# Altium schematic sheet Interface.SchDoc: VitalCore Interface
size A4; Organization: ETHZ D-ITET PBL, IIS; DocumentNumber: 2; SheetNumber: 2; SheetTotal: 3; FileInfo: Interface.SchDoc
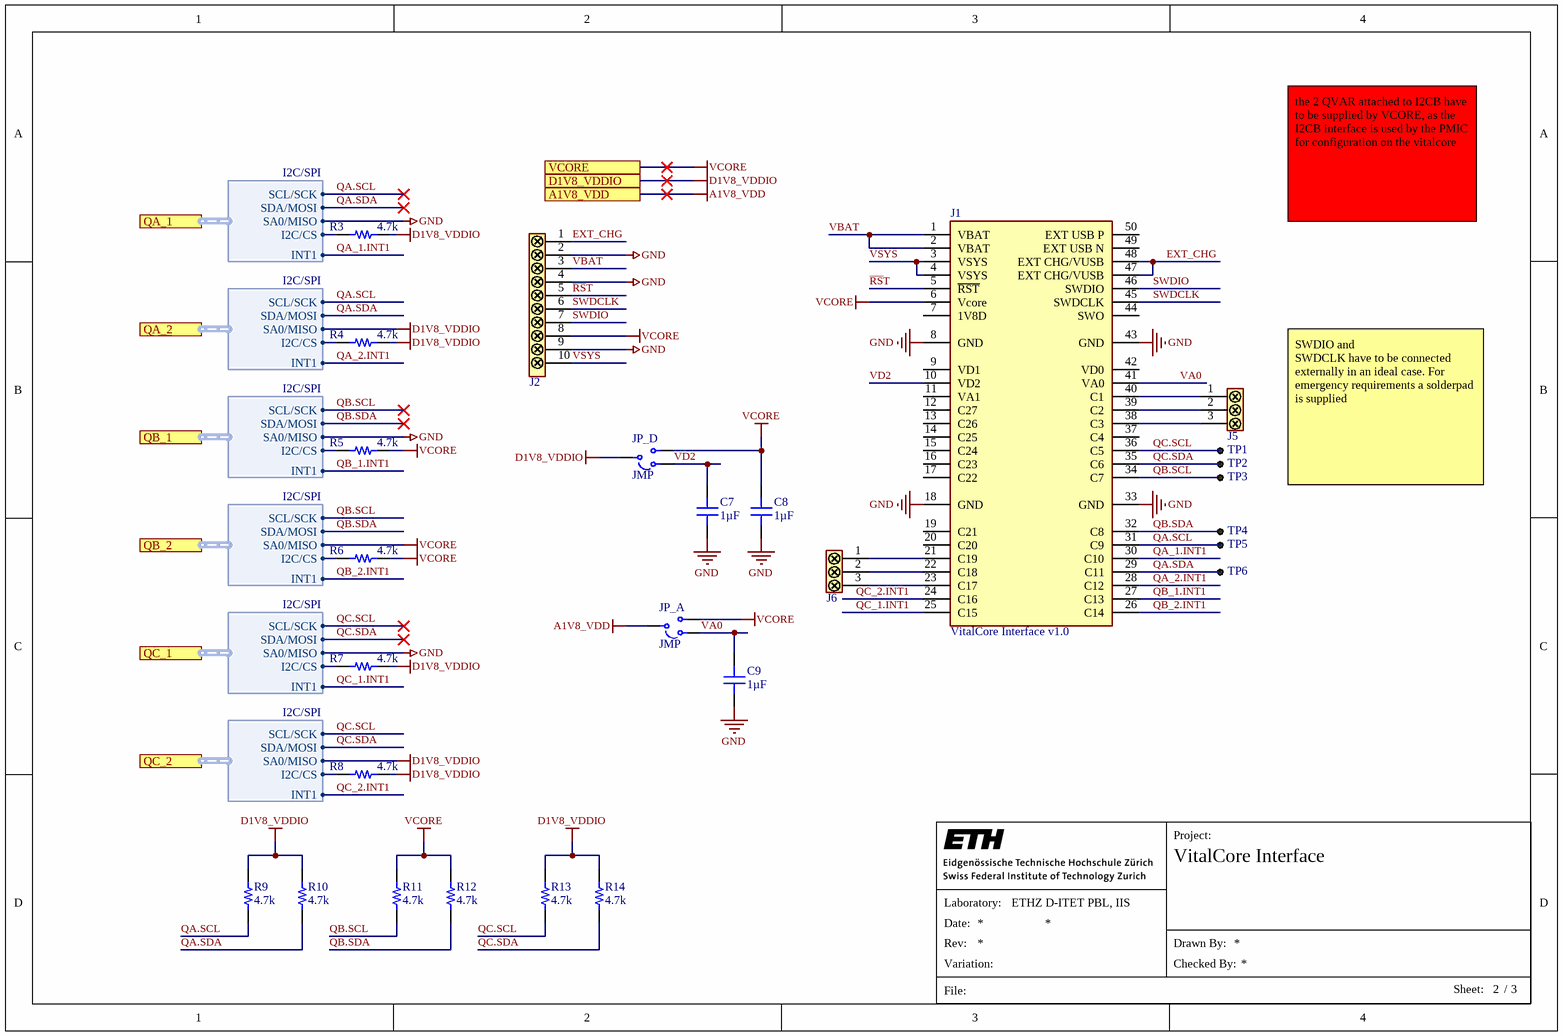
[diagram p0: Interface.SchDoc]

## Parts
C7  1µF  [CAP_0201]
C8  1µF  [CAP_0201]
C9  1µF  [CAP_0201]
J1  VitalCore Interface v1.0  [BACKPACK_INTERFACE_V1.0_2mm]
J2  FTS-110-01-L-S  [SAMTEC-FTS-110-01-L-S]  (value not drawn)
J5  FTS-103-01-L-S  [SAMTEC-FTS-103-01-X-S]  (value not drawn)
J6  FTS-103-01-L-S  [SAMTEC-FTS-103-01-X-S]  (value not drawn)
JP_A  JMP  [JMP_0201_3way]
JP_D  JMP  [JMP_0201_3way]
R3  4.7k  [RES_0201]
R4  4.7k  [RES_0201]
R5  4.7k  [RES_0201]
R6  4.7k  [RES_0201]
R7  4.7k  [RES_0201]
R8  4.7k  [RES_0201]
R9  4.7k  [RES_0201]
R10  4.7k  [RES_0201]
R11  4.7k  [RES_0201]
R12  4.7k  [RES_0201]
R13  4.7k  [RES_0201]
R14  4.7k  [RES_0201]
TP1  (no value)  [Pad-0.6mm]  (no BOM)
TP2  (no value)  [Pad-0.6mm]  (no BOM)
TP3  (no value)  [Pad-0.6mm]  (no BOM)
TP4  (no value)  [Pad-0.6mm]  (no BOM)
TP5  (no value)  [Pad-0.6mm]  (no BOM)
TP6  (no value)  [Pad-0.6mm]  (no BOM)

## Ports
A1V8_VDD, D1V8_VDDIO, QA_1 (harness I2C/SPI), QA_2 (harness I2C/SPI), QB_1 (harness I2C/SPI), QB_2 (harness I2C/SPI), QC_1 (harness I2C/SPI), QC_2 (harness I2C/SPI), VCORE

## Harnesses
I2C/SPI: SCL/SCK, SDA/MOSI, SA0/MISO, I2C/CS, INT1

## Nets
A1V8_VDD: JP_A.2 ; port A1V8_VDD
D1V8_VDDIO: JP_D.2 R3.1 R4.1 R7.1 R8.1 R9.1 R10.1 R13.1 R14.1 ; port D1V8_VDDIO, port QA_2.SA0/MISO, port QC_2.SA0/MISO
GND: C7.2 C8.2 C9.2 J1.8(GND) J1.18(GND) J1.33(GND) J1.43(GND) J2.2 J2.4 J2.9 ; port QA_1.SA0/MISO, port QB_1.SA0/MISO, port QC_1.SA0/MISO
VCORE: C8.1 J1.6(Vcore) J2.8 JP_A.3 JP_D.3 R5.1 R6.1 R11.1 R12.1 ; port VCORE, port QB_2.SA0/MISO
EXT_CHG: J1.47(EXT_CHG/VUSB) J1.48(EXT_CHG/VUSB) J2.1
QA.SCL: J1.31(C9) R9.2 TP5.1 ; port QA_1.SCL/SCK, port QA_2.SCL/SCK
QA.SDA: J1.29(C11) R10.2 TP6.1 ; port QA_1.SDA/MOSI, port QA_2.SDA/MOSI
QA_1.INT1: J1.30(C10) ; port QA_1.INT1
QA_2.INT1: J1.28(C12) ; port QA_2.INT1
QB.SCL: J1.34(C7) R11.2 TP3.1 ; port QB_1.SCL/SCK, port QB_2.SCL/SCK
QB.SDA: J1.32(C8) R12.2 TP4.1 ; port QB_1.SDA/MOSI, port QB_2.SDA/MOSI
QB_1.INT1: J1.27(C13) ; port QB_1.INT1
QB_2.INT1: J1.26(C14) ; port QB_2.INT1
QC.SCL: J1.36(C5) R13.2 TP1.1 ; port QC_1.SCL/SCK, port QC_2.SCL/SCK
QC.SDA: J1.35(C6) R14.2 TP2.1 ; port QC_1.SDA/MOSI, port QC_2.SDA/MOSI
QC_1.INT1: J1.25(C15) ; port QC_1.INT1
QC_2.INT1: J1.24(C16) ; port QC_2.INT1
~{RS}T: J1.5(~{RST}) J2.5
SWDCLK: J1.45(SWDCLK) J2.6
SWDIO: J1.46(SWDIO) J2.7
VA0: C9.1 J1.41(VA0) JP_A.1
VBAT: J1.1(VBAT) J1.2(VBAT) J2.3
VD2: C7.1 J1.10(VD2) JP_D.1
VSYS: J1.3(VSYS) J1.4(VSYS) J2.10
NetJ1_21: J1.21(C19) J6.1
NetJ1_22: J1.22(C18) J6.2
NetJ1_23: J1.23(C17) J6.3
NetJ1_38: J1.38(C3) J5.3
NetJ1_39: J1.39(C2) J5.2
NetJ1_40: J1.40(C1) J5.1
NetR3_2: R3.2 ; port QA_1.I2C/CS
NetR4_2: R4.2 ; port QA_2.I2C/CS
NetR5_2: R5.2 ; port QB_1.I2C/CS
NetR6_2: R6.2 ; port QB_2.I2C/CS
NetR7_2: R7.2 ; port QC_1.I2C/CS
NetR8_2: R8.2 ; port QC_2.I2C/CS

Not connected (* = marked no-connect by the designer): J1 7(1V8D) 9(VD1) 11(VA1) 12(C27) 13(C26) 14(C25) 15(C24) 16(C23) 17(C22) 19(C21) 20(C20) 37(C4) 42(VD0) 44(SWO) 49(EXT_USB_N) 50(EXT_USB_P)

## Notes on the sheet
- the 2 QVAR attached to I2CB have to be supplied by VCORE, as the I2CB interface is used by the PMIC for configuration on the vitalcore
- SWDIO and
  SWDCLK have to be connected externally in an ideal case. For emergency requirements a solderpad is supplied
- Project:
- Laboratory:
- Date:
- File:
- Rev:
- Variation:
- Drawn By:
- Checked By:
- Sheet:
- /

## Library data of the parts
C7-C9 = CAP_0201_1u_10V: CAP CER 1UF 10V X6S; Manufacturer: Murata; Manufacturer Part Number: GRM033C81A105ME05D; Capacitor Type: Ceramic; Multilayer: Yes; Tolerance  (fill in as +-): 20%; Supplier 1: Mouser; Supplier Part Number 1: 81-GRM033C81A105ME5D; Case/Package: 0201; Category: Ceramic Capacitors; ComponentLink1Description: https://psearch.en.murata.com:443/capacitor/product/GRM033C81A105ME05%23.pdf?src-supplier=IHS+Markit; ComponentLink1URL: https://psearch.en.murata.com:443/capacitor/product/GRM033C81A105ME05%23.pdf?src-supplier=IHS+Markit; ComponentLink2Description: http://search.murata.co.jp/Ceramy/image/img/A01X/G101/ENG/GRM033C81A105ME05-01.pdf?src-supplier=Digi-Key; ComponentLink2URL: http://search.murata.co.jp/Ceramy/image/img/A01X/G101/ENG/GRM033C81A105ME05-01.pdf?src-supplier=Digi-Key; ComponentLink3Description: https://datasheet.octopart.com/GRM033C81A105ME05D-Murata-datasheet-86813717.pdf?src-supplier=Future+Electronics; ComponentLink3URL: https://datasheet.octopart.com/GRM033C81A105ME05D-Murata-datasheet-86813717.pdf?src-supplier=Future+Electronics; ComponentLink4Description: https://datasheet.octopart.com/GRM033C81A105ME05D-Murata-datasheet-165579666.pdf?src-supplier=TME; ComponentLink4URL: https://datasheet.octopart.com/GRM033C81A105ME05D-Murata-datasheet-165579666.pdf?src-supplier=TME; Dielectric Material: Ceramic; JESD-609 Code: e3; Max Operating Temperature: 105°C; Min Operating Temperature: -55°C; Mounting Technology: Surface Mount; Package Shape: Rectangular; Packaging: Tape and Reel; Pins: 2; Pricing 1: 1=0.3, 10=0.147, 50=0.147, 100=0.095, 1000=0.079, 10000=0.066 (USD); Rated DC Voltage (URdc): 10V; Reach SVHC Compliant: Yes; RoHS: Yes; RoHS Compliant: Yes; Stock 1: 212716; Temperature Characteristics Code: X6S; Terminal Finish: Nickel; Termination: Wraparound; Tolerance (fill in as +-): 20%; Value: 1uF
J1 = BACKPACK_INTERFACE_V1.0: Manufacturer: Hirose; Manufacturer Part Number: DF40C(2.0)-50DS-0.4V(51); Manufacturer Series: DF40; Body/Shell Style: RECEPTACLE; Connector Type: BOARD STACKING CONNECTOR; Contact Pattern: RECTANGULAR; Contact Resistance: 90mR; Dielectric Withstanding Voltage (AC): 100V; Durability: 30Cycles; Insulation Resistance: 50MR; Mating Contact Pitch: 0.016inch; Mounting Option 1: LOCKING; Number Of Connectors: 1; Number of Contacts: 50; Number Of PCB Rows: 2; PCB Contact Row Spacing: 2.6416mm; Polarization Key: POLARIZED HOUSING; Rated Current (Signal): 300mA; Reference Standard: UL; Reliability: COMMERCIAL; Supplier 1: Mouser; Supplier Part Number 1: 798-DF40C2050DS04V51; Category: Connectors; ComponentLink1Description: https://datasheet.ciiva.com:443/pdfs/VipMasterIC/IC/HIRO/HIRO-S-A0003089604/HIRO-S-A0007946763-1.pdf?src-supplier=IHS+Markit; ComponentLink1URL: https://datasheet.ciiva.com:443/pdfs/VipMasterIC/IC/HIRO/HIRO-S-A0003089604/HIRO-S-A0007946763-1.pdf?src-supplier=IHS+Markit; ComponentLink2Description: https://www.hirose.com/product/download/?distributor=digikey&amp;type=specSheet&amp;lang=en&amp;num=DF40C(2.0)-50DS-0.4V(51)&src-supplier=Digi-Key; ComponentLink2URL: https://www.hirose.com/product/download/?distributor=digikey&amp;type=specSheet&amp;lang=en&amp;num=DF40C(2.0)-50DS-0.4V(51)&src-supplier=Digi-Key; ComponentLink3Description: https://www.hirose.com/product/en/download_file/key_name/DF40C%282.0%29-50DS-0.4V%2851%29/category/Specification%20Sheet/doc_file_id/46910/?file_category_id=9&item_id=06844091051&is_series=&src-supplier=Digi-Key; ComponentLink3URL: https://www.hirose.com/product/en/download_file/key_name/DF40C%282.0%29-50DS-0.4V%2851%29/category/Specification%20Sheet/doc_file_id/46910/?file_category_id=9&item_id=06844091051&is_series=&src-supplier=Digi-Key; ComponentLink4Description: http://www.hirose.co.jp/cataloge_hp/e68440018.pdf?src-supplier=Mouser; ComponentLink4URL: http://www.hirose.co.jp/cataloge_hp/e68440018.pdf?src-supplier=Mouser; Contact Finish - Mating: AU; Contact Gender: Female; Contact Material: Bronze; Insulation Color: Black; Insulation Material: Polymer; Max Operating Temperature: 85°C; Min Operating Temperature: -35°C; Mounting Style: STRAIGHT; Mounting Technology: Board; Number of Rows Loaded: 2; PCB Contact Pattern: RECTANGULAR; Pricing 1: 1=1.44, 10=1.14, 50=1.14, 100=0.99, 1000=0.792, 10000=0.643 (USD); RoHS: Yes; RoHS Compliant: Yes; Stock 1: 16932; Terminal Pitch: 4.064mm; Termination: SMD/SMT
J2 = FTS-110-01-L-S: Pinheader 10 pin, 1.27mm; Manufacturer: Samtec; Manufacturer Series: FTS; Connector Type: BOARD CONNECTOR; Option: General Purpose; Mixed Contacts: No; Number of Rows Loaded: 1; Number of Contacts: 10; Additional Feature: Low Profile; Supplier 1: Mouser; Manufacturer Part Number: FTS-110-01-L-S; RoHS: Yes; Category: Connectors; Stock 1: 83; Pricing 1: 1=2.85, 10=2.62, 50=2.62, 100=2.28, 1000=1.66, 10000=1.48 (USD); Mounting Technology: Board; Contact Material: Bronze; Contact Finish - Mating: GOLD (10) OVER NICKEL (50); Contact Finish - Termination: Matte Tin (Sn) - with Nickel (Ni) barrier; JESD-609 Code: e3; Contact Gender: Male; Mounting Style: STRAIGHT; Termination: Solder; Terminal Pitch: 1.27mm; Flammability Rating: UL94 V-0; IEC Conformance: No; MIL Conformance: No; Reach SVHC Compliant: Yes; RoHS Compliant: Yes; ComponentLink1URL: https://datasheet.ciiva.com:443/pdfs/VipMasterIC/IC/SAMI/SAMI-S-A0001504673/SAMI-S-A0001504673-1.pdf?src-supplier=IHS+Markit; ComponentLink1Description: https://datasheet.ciiva.com:443/pdfs/VipMasterIC/IC/SAMI/SAMI-S-A0001504673/SAMI-S-A0001504673-1.pdf?src-supplier=IHS+Markit; Supplier Part Number 1: 200-FTS11001LS; ComponentLink2Description: http://www.samtec.com/documents/webfiles/pdf/FTS.pdf?src-supplier=Avnet; ComponentLink2URL: http://www.samtec.com/documents/webfiles/pdf/FTS.pdf?src-supplier=Avnet; ComponentLink3Description: https://datasheet.octopart.com/FTS-110-01-L-S-Samtec-datasheet-151470456.pdf?src-supplier=Sager+Electronics; ComponentLink3URL: https://datasheet.octopart.com/FTS-110-01-L-S-Samtec-datasheet-151470456.pdf?src-supplier=Sager+Electronics; ComponentLink4Description: https://datasheet.octopart.com/FTS-110-01-L-S-Samtec-datasheet-118493358.pdf?src-supplier=Electro+Sonic; ComponentLink4URL: https://datasheet.octopart.com/FTS-110-01-L-S-Samtec-datasheet-118493358.pdf?src-supplier=Electro+Sonic; ComponentLink5Description: https://datasheet.octopart.com/FTS-110-01-L-S-Samtec-datasheet-116535195.pdf?src-supplier=Toby+Electronics; ComponentLink5URL: https://datasheet.octopart.com/FTS-110-01-L-S-Samtec-datasheet-116535195.pdf?src-supplier=Toby+Electronics; DIN Conformance: No; Filter Feature: No
J5 J6 = FTS-103-01-L-S: Pinheader 3 pin, 1.27mm; Manufacturer: Samtec; Manufacturer Series: FTS; Connector Type: BOARD CONNECTOR; Option: General Purpose; Mixed Contacts: No; Number of Rows Loaded: 1; Number of Contacts: 3; Additional Feature: Low Profile; Supplier 1: Mouser; Manufacturer Part Number: FTS-103-01-L-S; RoHS: Yes; Category: Connectors; Stock 1: 1110; Pricing 1: 1=1.18, 10=1.18, 50=1.18, 100=0.887, 1000=0.65, 10000=0.481 (USD); Mounting Technology: Board; Contact Material: Bronze; Contact Finish - Mating: GOLD (10) OVER NICKEL (50); Contact Finish - Termination: Matte Tin (Sn) - with Nickel (Ni) barrier; JESD-609 Code: e3; Contact Gender: Male; Mounting Style: STRAIGHT; Termination: Solder; Terminal Pitch: 1.27mm; Flammability Rating: UL94 V-0; IEC Conformance: No; MIL Conformance: No; Reach SVHC Compliant: Yes; RoHS Compliant: Yes; ComponentLink1URL: https://datasheet.ciiva.com:443/pdfs/VipMasterIC/IC/SAMI/SAMI-S-A0001504673/SAMI-S-A0001504673-1.pdf?src-supplier=IHS+Markit; ComponentLink1Description: https://datasheet.ciiva.com:443/pdfs/VipMasterIC/IC/SAMI/SAMI-S-A0001504673/SAMI-S-A0001504673-1.pdf?src-supplier=IHS+Markit; ComponentLink2Description: http://suddendocs.samtec.com/prints/fts-1xx-xx-x-sx-mkt.pdf?src-supplier=Digi-Key; ComponentLink2URL: http://suddendocs.samtec.com/prints/fts-1xx-xx-x-sx-mkt.pdf?src-supplier=Digi-Key; ComponentLink3Description: http://suddendocs.samtec.com/prints/fts-1xx-xx-xx-xx-xx-mkt.pdf?src-supplier=Digi-Key; ComponentLink3URL: http://suddendocs.samtec.com/prints/fts-1xx-xx-xx-xx-xx-mkt.pdf?src-supplier=Digi-Key; ComponentLink4Description: ftp://ftp.samtec.com/webfiles/PDF/FTS.PDF?src-supplier=Avnet; ComponentLink4URL: ftp://ftp.samtec.com/webfiles/PDF/FTS.PDF?src-supplier=Avnet; DIN Conformance: No; Filter Feature: No; Supplier Part Number 1: 200-FTS10301LS
JP_A JP_D = JMP_0201_3w: JMP 0201 3W; Manufacturer: Panasonic; Manufacturer Part Number: ERJ-1GN0R00C; Package Height: 0.23mm; Package Length: 0.6mm; Package Width: 0.3mm; Power: 50mW; Rated Temperature: 70°C; Reference Standard: AEC-Q200; Value: 0R; Case/Package: 0201; Category: Chip SMD Resistors; ComponentLink1Description: https://datasheet.ciiva.com:443/pdfs/VipMasterIC/IC/PANA/PANA-S-A0009459603/PANA-S-A0009459603-1.pdf?src-supplier=IHS+Markit; ComponentLink1URL: https://datasheet.ciiva.com:443/pdfs/VipMasterIC/IC/PANA/PANA-S-A0009459603/PANA-S-A0009459603-1.pdf?src-supplier=IHS+Markit; ComponentLink2Description: https://datasheet.ciiva.com/22730/1678796-22730749.pdf?src-supplier=Element14; ComponentLink2URL: https://datasheet.ciiva.com/22730/1678796-22730749.pdf?src-supplier=Element14; Construction: Rectangular; JESD-609 Code: e3; Max Operating Temperature: 125°C; Min Operating Temperature: -55°C; Mounting Technology: Surface Mount; Package Shape: Rectangular; Package Style: SMTMeter; Packaging: Tape and Reel; Pins: 2; Pricing 1: 1=0.1, 10=0.016, 50=0.016, 100=0.007, 1000=0.007, 10000=0.005 (USD); Reach SVHC Compliant: Yes; Resistor Type: FIXED RESISTOR; RoHS: Yes; RoHS Compliant: Yes; Stock 1: 2803988; Supplier 1: Mouser; Supplier Part Number 1: 667-ERJ-1GN0R00C; Technology: METAL GLAZE/THICK FILM; Terminal Finish: Nickel; Termination: Wraparound
R3-R14 = R_0201_4.7K: R 4.7K 1% 50mW 0201; Manufacturer: Panasonic; Manufacturer Part Number: ERJ-1GNF4701C; Rated Temperature: 70°C; Temperature Coefficient: 200ppm/°C; Working Voltage: 25V; Package Height: 0.23mm; Package Length: 0.6mm; Package Width: 0.3mm; Reference Standard: AEC-Q200; Supplier 1: Mouser; RoHS: Yes; Category: Chip SMD Resistors; Stock 1: 339994; Pricing 1: 1=0.1, 10=0.023, 50=0.023, 100=0.014, 1000=0.01, 10000=0.007 (USD); Mounting Technology: Surface Mount; Pins: 2; Package Shape: Rectangular; Case/Package: 0201; Terminal Finish: Nickel; Min Operating Temperature: -55°C; Max Operating Temperature: 125°C; Tolerance: 1%; JESD-609 Code: e3; Resistor Type: FIXED RESISTOR; Construction: Rectangular; Package Style: SMTMeter; Packaging: Tape and Reel; Power: 50mW; Value: 4.7k; Technology: METAL GLAZE/THICK FILM; Termination: Wraparound; Reach SVHC Compliant: Yes; RoHS Compliant: Yes; ComponentLink1URL: https://datasheet.ciiva.com:443/pdfs/VipMasterIC/IC/PANA/PANA-S-A0009889626/PANA-S-A0009889626-1.pdf?src-supplier=IHS+Markit; ComponentLink1Description: https://datasheet.ciiva.com:443/pdfs/VipMasterIC/IC/PANA/PANA-S-A0009889626/PANA-S-A0009889626-1.pdf?src-supplier=IHS+Markit; Supplier Part Number 1: 667-ERJ-1GNF4701C; ComponentLink2Description: https://datasheet.ciiva.com/30079/erj1gn-30079779.pdf?src-supplier=Onlinecomponents.com; ComponentLink2URL: https://datasheet.ciiva.com/30079/erj1gn-30079779.pdf?src-supplier=Onlinecomponents.com
TP1-TP6 = CMP-00224-2: 0.6mm SMT Test Pad; Mounting Technology: SMT